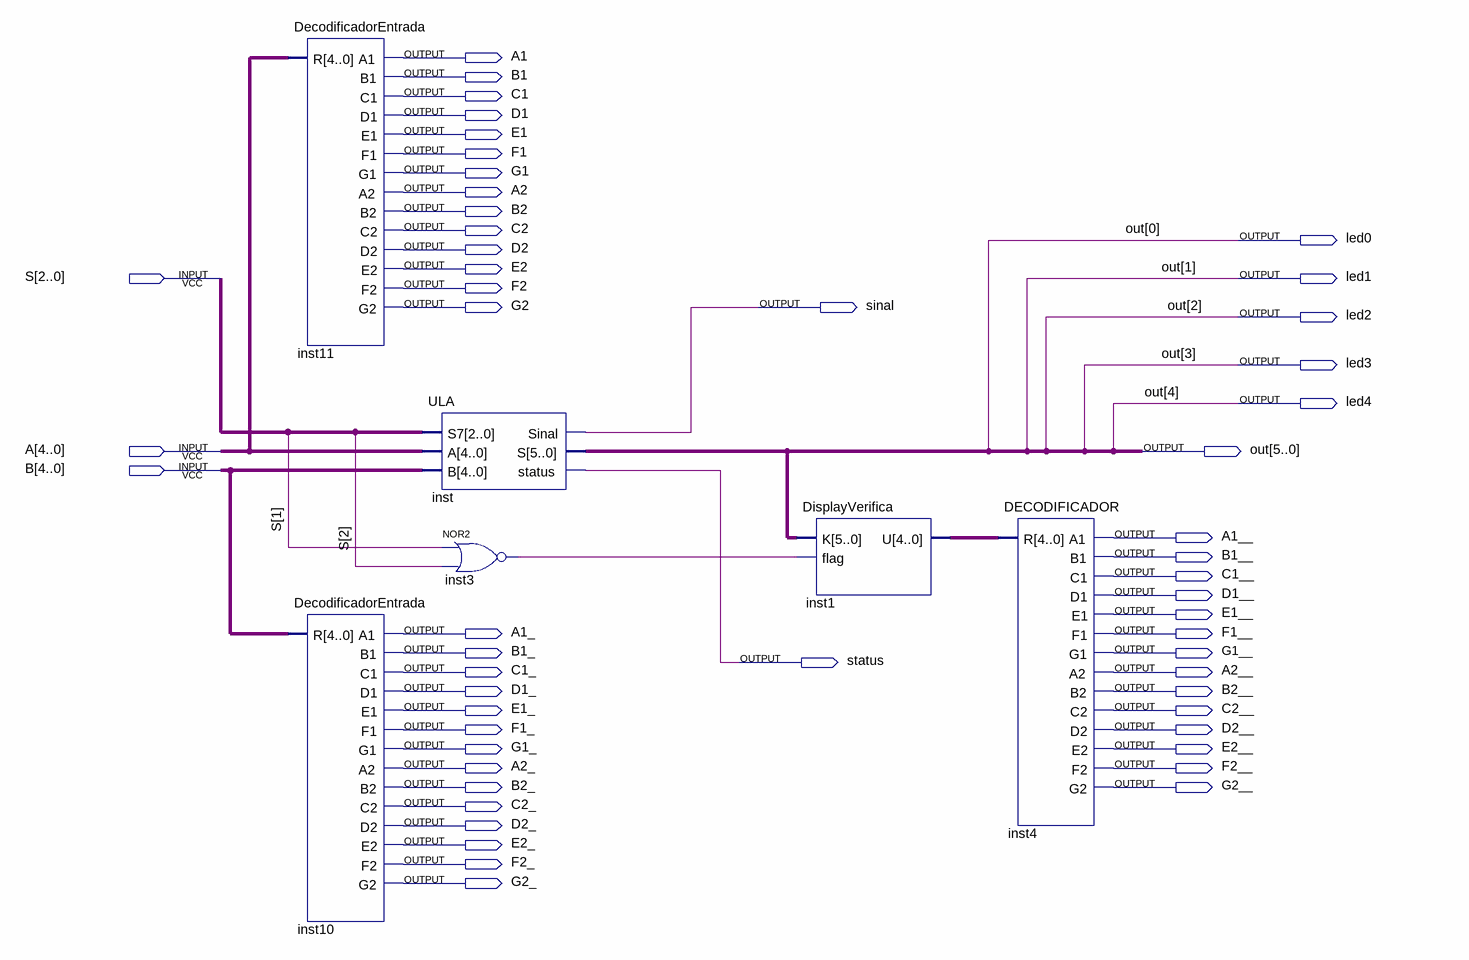
[diagram p0: schematic sheet]
// Quartus schematic CircuitoCompleto.bdf as structural Verilog: 6 symbols, 53 pins
module CircuitoCompleto (
  input  [2:0] S,
  input  [4:0] A,
  input  [4:0] B,
  output A1,
  output B1,
  output C1,
  output D1,
  output E1,
  output F1,
  output G1,
  output A2,
  output B2,
  output C2,
  output led0,
  output D2,
  output E2,
  output led1,
  output F2,
  output G2,
  output sinal,
  output led2,
  output led3,
  output led4,
  output [5:0] out,
  output A1__,
  output B1__,
  output C1__,
  output D1__,
  output E1__,
  output A1_,
  output F1__,
  output B1_,
  output G1__,
  output status,
  output C1_,
  output A2__,
  output D1_,
  output B2__,
  output E1_,
  output C2__,
  output F1_,
  output D2__,
  output G1_,
  output E2__,
  output A2_,
  output F2__,
  output B2_,
  output G2__,
  output C2_,
  output D2_,
  output E2_,
  output F2_,
  output G2_
);

  wire inst3_out;
  wire [4:0] inst1_u;

  DecodificadorEntrada inst11 (
    .R(A), .A1(A[1]), .B1(B[1]), .C1(C1), .D1(D1), .E1(E1), .F1(F1), .G1(G1), .A2(A[2]), .B2(B[2]), .C2(C2),
    .D2(D2), .E2(E2), .F2(F2), .G2(G2));
  DecodificadorEntrada inst10 (
    .R(B), .A1(A1_), .B1(B1_), .C1(C1_), .D1(D1_), .E1(E1_), .F1(F1_), .G1(G1_), .A2(A2_), .B2(B2_),
    .C2(C2_), .D2(D2_), .E2(E2_), .F2(F2_), .G2(G2_));
  ULA inst (.S7(S), .A(A), .B(B), .Sinal(sinal), .S({out[5], led4, led3, led2, led1, led0}), .status(status));
  nor inst3 (inst3_out, S[1], S[2]);
  DisplayVerifica inst1 (.K({out[5], led4, led3, led2, led1, led0}), .flag(inst3_out), .U(inst1_u));
  DECODIFICADOR inst4 (
    .R(inst1_u), .A1(A1__), .B1(B1__), .C1(C1__), .D1(D1__), .E1(E1__), .F1(F1__), .G1(G1__), .A2(A2__),
    .B2(B2__), .C2(C2__), .D2(D2__), .E2(E2__), .F2(F2__), .G2(G2__));

  assign A1 = A[1];
  assign A2 = A[2];
  assign B1 = B[1];
  assign B2 = B[2];
  assign out[4:0] = {led4, led3, led2, led1, led0};
endmodule
